# EAGLE design binarybox-barrel (EAGLE 7.3.0)
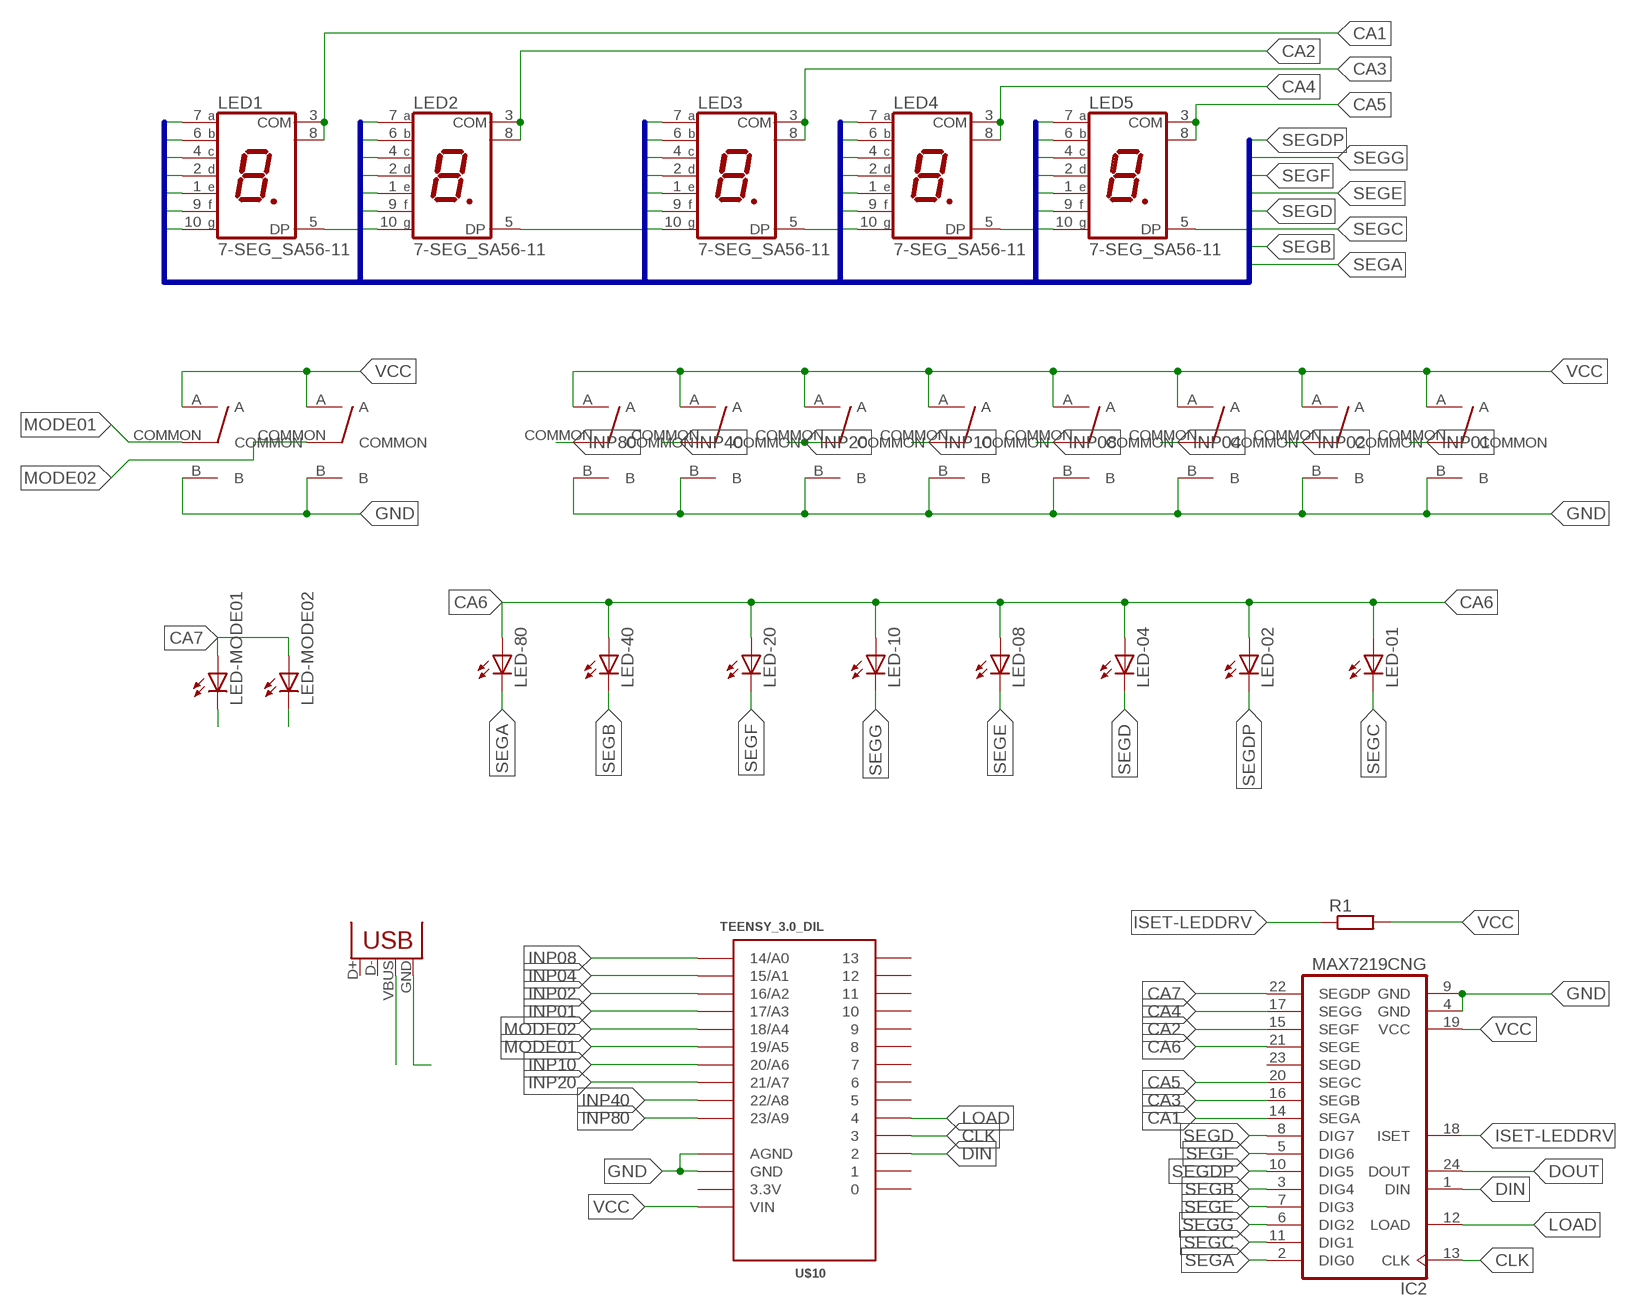
[diagram p0: schematic, sheet 1]

## Parts
IC2  MAX7219CNG  [DIL24-3]
LED1  7-SEG_SA56-11  [SA56-11]
LED2  7-SEG_SA56-11  [SA56-11]
LED3  7-SEG_SA56-11  [SA56-11]
LED4  7-SEG_SA56-11  [SA56-11]
LED5  7-SEG_SA56-11  [SA56-11]
LED-01  LED5MM  [LED5MM]
LED-02  LED5MM  [LED5MM]
LED-04  LED5MM  [LED5MM]
LED-08  LED5MM  [LED5MM]
LED-10  LED5MM  [LED5MM]
LED-20  LED5MM  [LED5MM]
LED-40  LED5MM  [LED5MM]
LED-80  LED5MM  [LED5MM]
LED-MODE01  LED5MM  [LED5MM]
LED-MODE02  LED5MM  [LED5MM]
R1  R-EU_0207/10  [0207/10]
U$1  ARROW-AB-SWITCH  [333-333]
U$2  ARROW-AB-SWITCH  [333-333]
U$3  ARROW-AB-SWITCH  [333-333]
U$4  ARROW-AB-SWITCH  [333-333]
U$5  ARROW-AB-SWITCH  [333-333]
U$6  ARROW-AB-SWITCH  [333-333]
U$7  ARROW-AB-SWITCH  [333-333]
U$8  ARROW-AB-SWITCH  [333-333]
U$10  TEENSY_3.0_DIL  [TEENSY3-DIL]
U$11  ARROW-AB-SWITCH  [333-333]
U$13  ARROW-AB-SWITCH  [333-333]
X1  USBPTH  [USB-B-PTH]

## Nets
CA1: IC2.14(SEGA) LED1.3(COM) LED1.8(COM)
CA2: IC2.15(SEGF) LED2.3(COM) LED2.8(COM)
CA3: IC2.16(SEGB) LED3.3(COM) LED3.8(COM)
CA4: IC2.17(SEGG) LED4.3(COM) LED4.8(COM)
CA5: IC2.20(SEGC) LED5.3(COM) LED5.8(COM)
CA6: IC2.21(SEGE) LED-01.A LED-02.A LED-04.A LED-08.A LED-10.A LED-20.A LED-40.A LED-80.A
CA7: IC2.22(SEGDP) LED-MODE01.A LED-MODE02.A
CLK: IC2.13(CLK) U$10.3
DIN: IC2.1(DIN) U$10.2
DOUT: IC2.24(DOUT)
GND: IC2.4(GND) IC2.9(GND) U$1.B U$2.B U$3.B U$4.B U$5.B U$6.B U$7.B U$8.B U$10.AGND U$10.GND U$11.B U$13.B X1.GND
INP01: U$8.COMMON U$10.17/A3
INP02: U$7.COMMON U$10.16/A2
INP04: U$6.COMMON U$10.15/A1
INP08: U$5.COMMON U$10.14/A0
INP10: U$4.COMMON U$10.20/A6
INP20: U$3.COMMON U$10.21/A7
INP40: U$2.COMMON U$10.22/A8
INP80: U$1.COMMON U$10.23/A9
ISET-LEDDRV: IC2.18(ISET) R1.1
LOAD: IC2.12(LOAD) U$10.4
MODE01: U$10.19/A5 U$11.COMMON
MODE02: U$10.18/A4 U$13.COMMON
SEGA: IC2.2(DIG0) LED1.7(A) LED2.7(A) LED3.7(A) LED4.7(A) LED5.7(A) LED-80.K(C)
SEGB: IC2.3(DIG4) LED1.6(B) LED2.6(B) LED3.6(B) LED4.6(B) LED5.6(B) LED-40.K(C)
SEGC: IC2.11(DIG1) LED1.4(C) LED2.4(C) LED3.4(C) LED4.4(C) LED5.4(C) LED-01.K(C) LED-MODE01.K(C)
SEGD: IC2.8(DIG7) LED1.2(D) LED2.2(D) LED3.2(D) LED4.2(D) LED5.2(D) LED-04.K(C)
SEGDP: IC2.10(DIG5) LED1.5(DP) LED2.5(DP) LED3.5(DP) LED4.5(DP) LED5.5(DP) LED-02.K(C) LED-MODE02.K(C)
SEGE: IC2.7(DIG3) LED1.1(E) LED2.1(E) LED3.1(E) LED4.1(E) LED5.1(E) LED-08.K(C)
SEGF: IC2.5(DIG6) LED1.9(F) LED2.9(F) LED3.9(F) LED4.9(F) LED5.9(F) LED-20.K(C)
SEGG: IC2.6(DIG2) LED1.10(G) LED2.10(G) LED3.10(G) LED4.10(G) LED5.10(G) LED-10.K(C)
VCC: IC2.19(VCC) R1.2 U$1.A U$2.A U$3.A U$4.A U$5.A U$6.A U$7.A U$8.A U$10.VIN U$11.A U$13.A X1.VBUS
Unconnected: IC2.23(SEGD) U$10.0 U$10.1 U$10.5 U$10.6 U$10.7 U$10.8 U$10.9 U$10.10 U$10.11 U$10.12 U$10.13 X1.D+ X1.D-

## Buses
SEG[10..17]

## Power pins joined to a net without a drawn wire
3.3V: U$10.3.3V

## Library data of the parts
IC2 = maxim:MAX7219CNG: LED DISPLAY DRIVER; MF: MAXIM; MPN: MAX7219CNG; OC_FARNELL: 1523914; OC_NEWARK: 34C4018
LED1-LED5 = display-kingbright:7-SEG_: Kingbright 14.2mm (0.56 INCH) SINGLE DIGIT NUMERIC DUISPLAY Source: SA56-11EWA(Ver1189471036.pdf; OC_FARNELL: unknown; OC_NEWARK: unknown
LED-01 LED-02 LED-04 LED-08 LED-10 LED-20 LED-40 LED-80 LED-MODE01 LED-MODE02 = led:LED: LED OSRAM: - CHIPLED LG R971, LG N971, LY N971, LG Q971, LY Q971, LO R971, LY R971 LH N974, LH R974 LS Q976, LO Q976, LY Q976 LO Q996 - Hyper CHIPLED LW Q18S LB Q993, LB Q99A, LB R99A - SideLED LS A670, LO A670, LY A670, LG A670, LP A670 LB A673, LV A673, LT A673, LW A673 LH A674 LY A675 LS A676, LA A676, LO A676, LY A676, LW A676 LS A679, LY A679, LG A679 - Hyper Micro SIDELED® LS Y876, LA Y876, LO Y876, LY Y876 LT Y87S - SmartLED LW L88C, LW L88S LB L89C, LB L89S, LG L890 LS L89K, LO L89K, LY L89K LS L896, LA L896, LO L896, LY L896 - TOPLED LS T670, LO T670, LY T670, LG T670, LP T670 LSG T670, LSP T670, LSY T670, LOP T670, LYG T670 LG T671, LOG T671, LSG T671 LB T673, LV T673, LT T673, LW T673 LH T674 LS T676, LA T676, LO T676, LY T676, LB T676, LH T676, LSB T676, LW T676 LB T67C, LV T67C, LT T67C, LS T67K, LO T67K, LY T67K, LW E67C LS E67B, LA E67B, LO E67B, LY E67B, LB E67C, LV E67C, LT E67C LW T67C LS T679, LY T679, LG T679 LS T770, LO T770, LY T770, LG T770, LP T770 LB T773, LV T773, LT T773, LW T773 LH T774 LS E675, LA E675, LY E675, LS T675 LS T776, LA T776, LO T776, LY T776, LB T776 LHGB T686 LT T68C, LB T68C - Hyper Mini TOPLED® LB M676 - Mini TOPLED Santana® LG M470 LS M47K, LO M47K, LY M47K Source: http://www.osram.convergy.de LUXEON: - LUMILED® LXK2-PW12-R00, LXK2-PW12-S00, LXK2-PW14-U00, LXK2-PW14-V00 LXK2-PM12-R00, LXK2-PM12-S00, LXK2-PM14-U00 LXK2-PE12-Q00, LXK2-PE12-R00, LXK2-PE12-S00, LXK2-PE14-T00, LXK2-PE14-U00 LXK2-PB12-K00, LXK2-PB12-L00, LXK2-PB12-M00, LXK2-PB14-N00, LXK2-PB14-P00, LXK2-PB14-Q00 LXK2-PR12-L00, LXK2-PR12-M00, LXK2-PR14-Q00, LXK2-PR14-R00 LXK2-PD12-Q00, LXK2-PD12-R00, LXK2-PD12-S00 LXK2-PH12-R00, LXK2-PH12-S00 LXK2-PL12-P00, LXK2-PL12-Q00, LXK2-PL12-R00 Source: www.luxeon.com KINGBRIGHT: KA-3528ASYC Source: www.kingbright.com
R1 = resistor:R-EU_: RESISTOR, European symbol
U$1-U$8 U$11 U$13 = switch-cr-arrow:ARROW-AB-SWITCH
U$10 = Teensy_3_and_LC_Series_Boards_v1.0:TEENSY_3.0_DIL: TEENSY 3.0 in a classic breadboard layout - pins between the two outer rows.
X1 = SparkFun:USB: USB Connectors USB-B-PTH is fully proven SKU : PRT-00139 USB-miniB is fully proven SKU : PRT-00587 USB-A-PCB is untested. USB-A-H is throughly reviewed, but untested. Spark Fun Electronics SKU : PRT-00437 USB-B-SMT is throughly reviewed, but untested. Needs silkscreen touching up. USB-A-S has not been used/tested USB-MB-H has not been used/tested

## Board
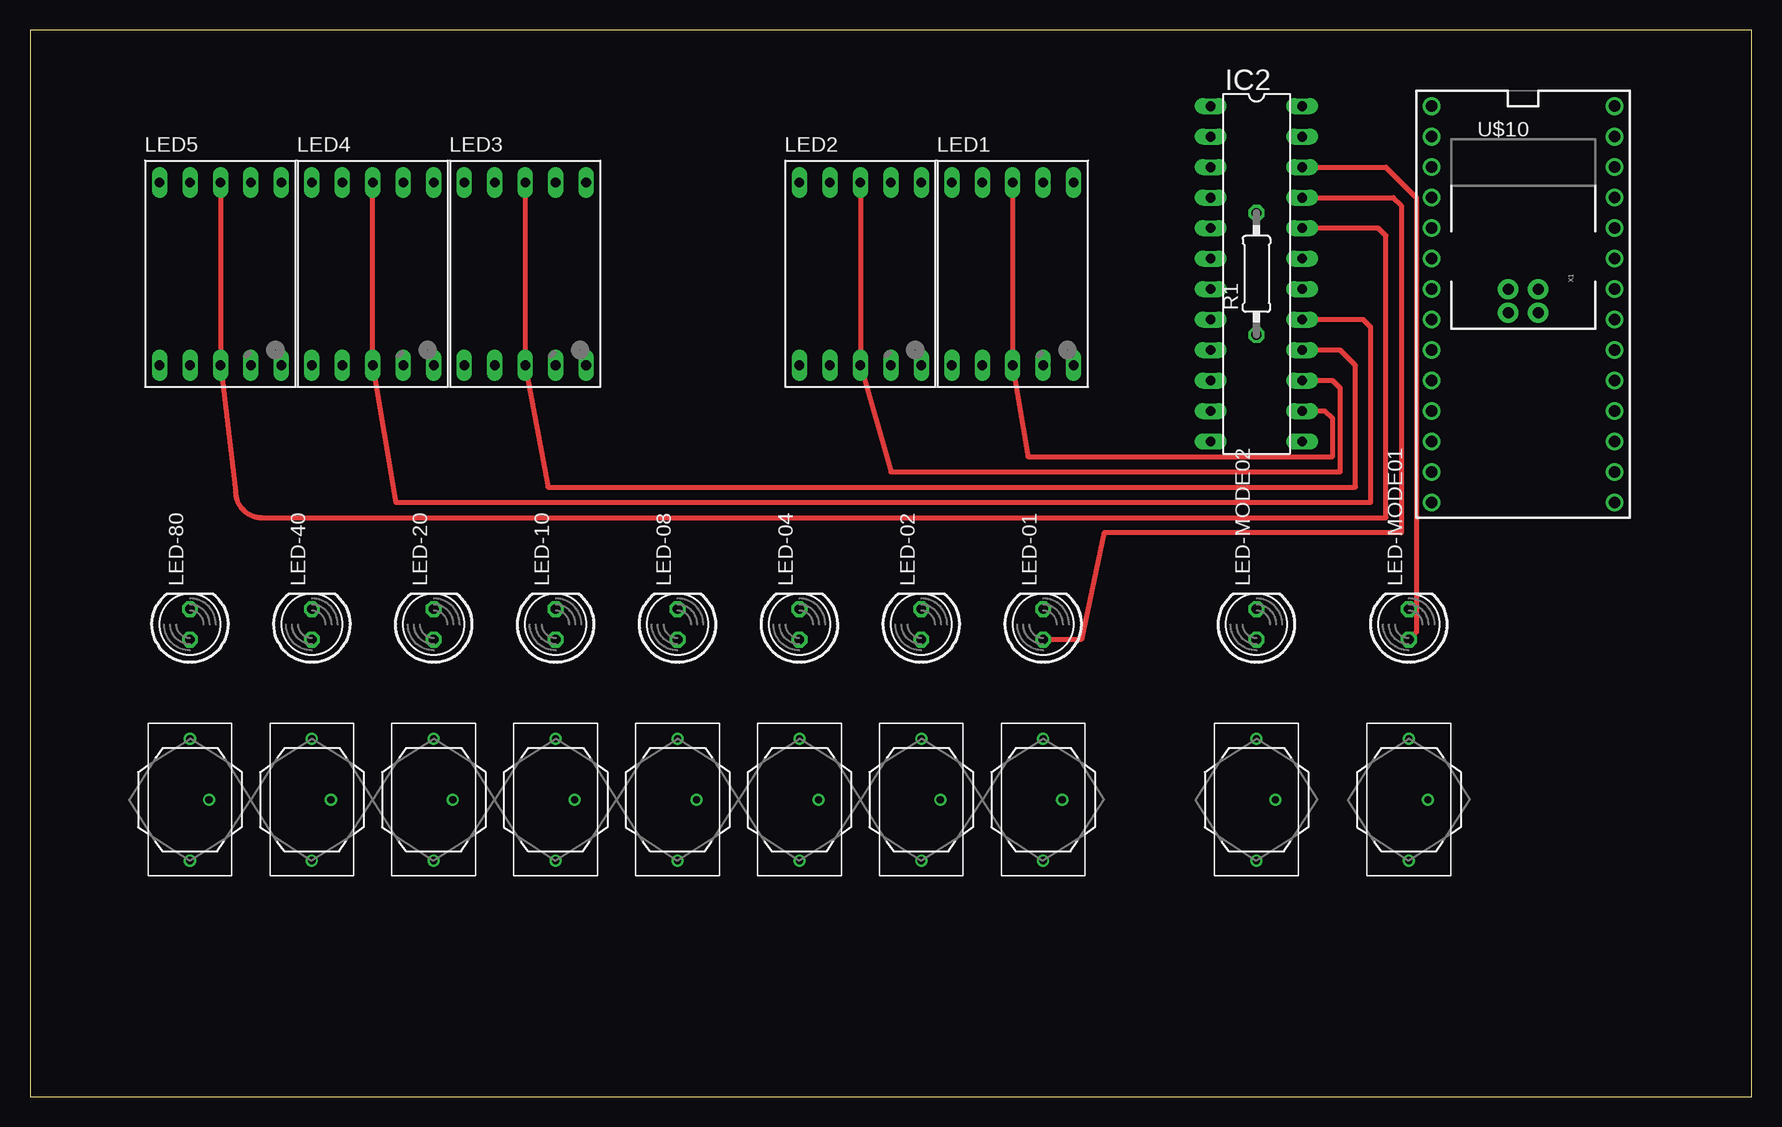
[diagram p1: board, top side]
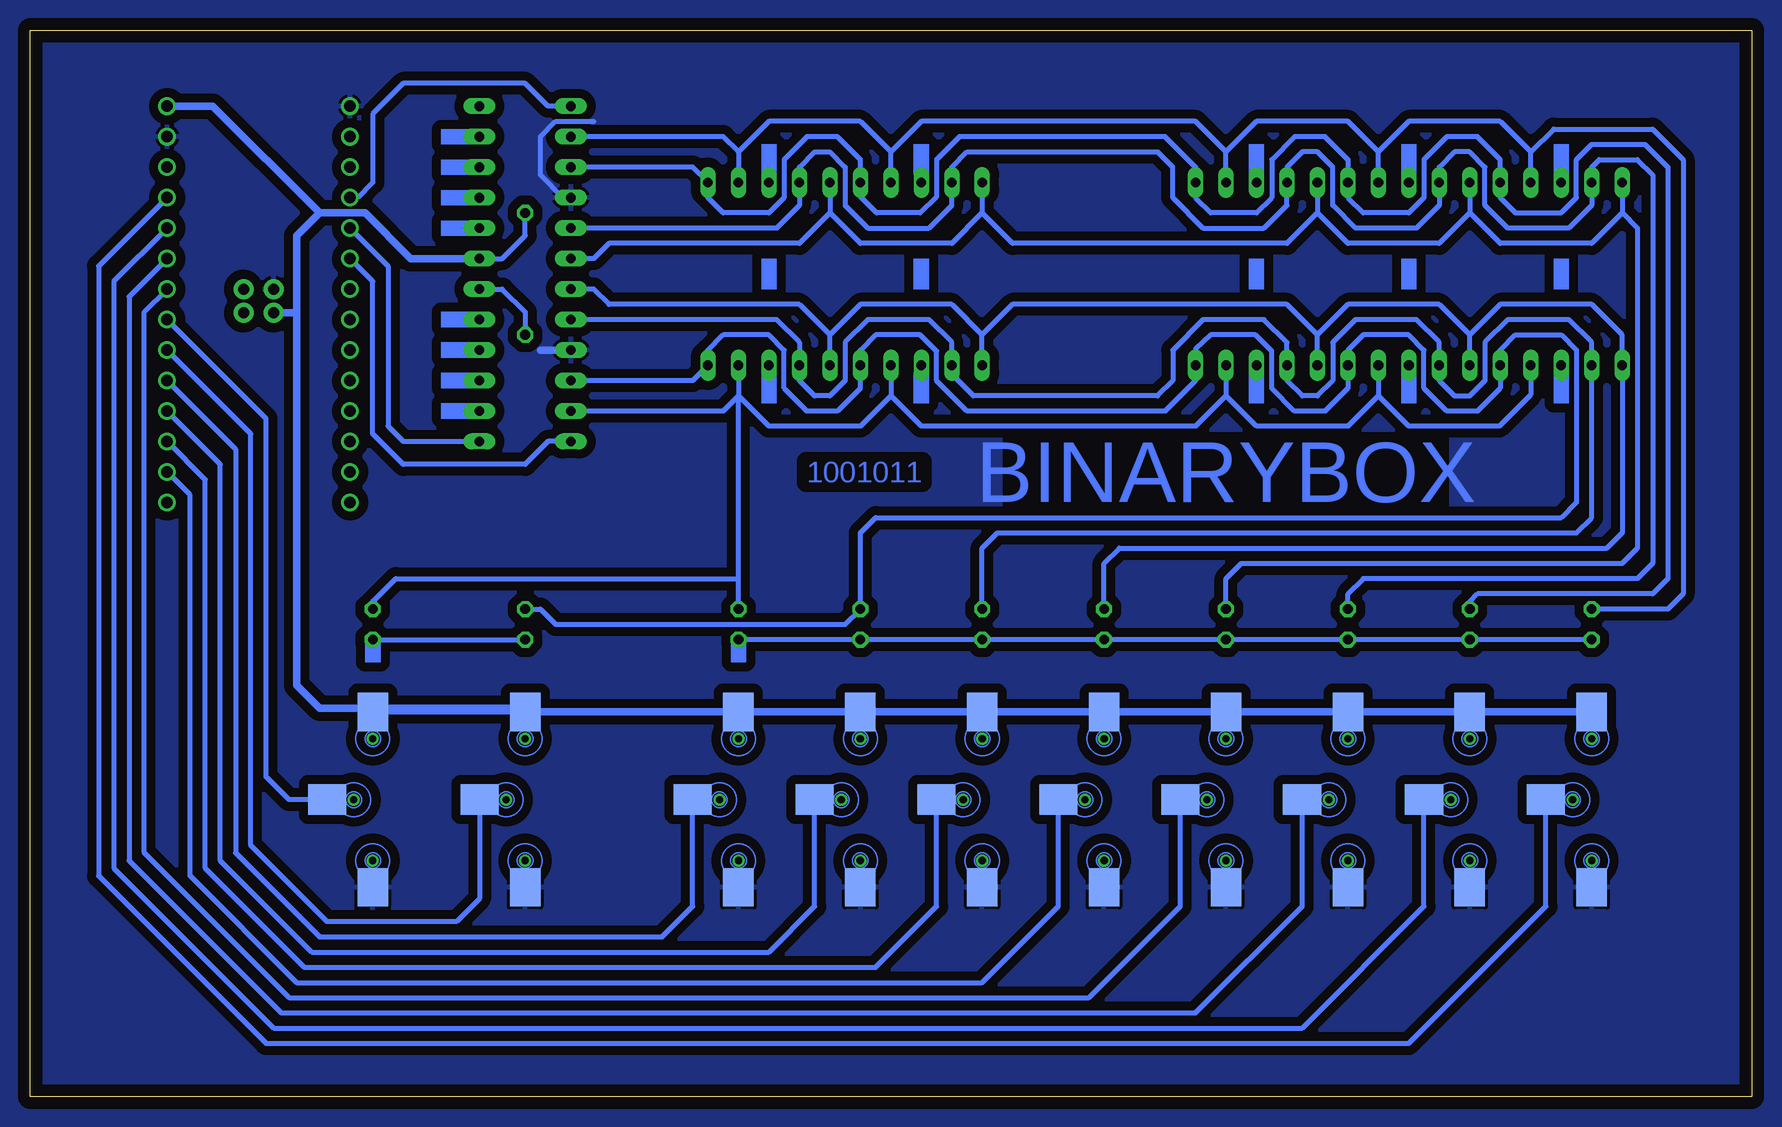
[diagram p2: board, bottom side, seen from below]

Size 143.51 x 88.9 mm. Coordinates in mm from the lower left corner, seen from the top.
Outline: 0,0 143.51,0 143.51,88.9 0,88.9 0,0
Copper layers (1*16): Top 0.035mm / dielectric 1.5mm / Bottom 0.035mm
Design rules "default": minimum track width 10mil, minimum drill 24mil, track to track 8mil, track to pad 8mil, pad to pad 8mil, via to via 8mil, smd to smd 8mil, copper to edge 40mil, drill to drill 8mil, minimum pad ring 10mil, minimum via ring 8mil, stop-mask expansion 4mil, vias tented up to drill 0mil, thermal gap 10mil

### Footprints (pad centres in the part's own frame; a part is rotated, then mirrored left to right if it is on the bottom)
DIL24-3 = drill 0.813 long: 1 -13.97,-3.81; 2 -11.43,-3.81; 3 -8.89,-3.81; 4 -6.35,-3.81; 5 -3.81,-3.81; 6 -1.27,-3.81; 7 1.27,-3.81; 8 3.81,-3.81; 9 6.35,-3.81; 10 8.89,-3.81; 11 11.43,-3.81; 12 13.97,-3.81; 13 13.97,3.81; 14 11.43,3.81; 15 8.89,3.81; 16 6.35,3.81; 17 3.81,3.81; 18 1.27,3.81; 19 -1.27,3.81; 20 -3.81,3.81; 21 -6.35,3.81; 22 -8.89,3.81; 23 -11.43,3.81; 24 -13.97,3.81
SA56-11 = drill 0.8 long: 1 -5.08,-7.62; 2 -2.54,-7.62; 3 0,-7.62; 4 2.54,-7.62; 5 5.08,-7.62; 6 5.08,7.62; 7 2.54,7.62; 8 0,7.62; 9 -2.54,7.62; 10 -5.08,7.62
LED5MM = drill 0.813 octagon: A -1.27,0; K 1.27,0
0207/10 = drill 0.813 octagon: 1 -5.08,0; 2 5.08,0
333-333 = smd 2.54 x 3.175 bottom: A 0,7.303; B 0,-7.303 | smd 3.175 x 2.54 bottom: COMMON 3.81,0
TEENSY3-DIL = drill 0.965: 0 -7.62,13.97; 1 -7.62,11.43; 2 -7.62,8.89; 3 -7.62,6.35; 3.3V 7.62,11.43; 4 -7.62,3.81; 5 -7.62,1.27; 6 -7.62,-1.27; 7 -7.62,-3.81; 8 -7.62,-6.35; 9 -7.62,-8.89; 10 -7.62,-11.43; 11 -7.62,-13.97; 12 -7.62,-16.51; 13 7.62,-16.51; 14/A0 7.62,-13.97; 15/A1 7.62,-11.43; 16/A2 7.62,-8.89; 17/A3 7.62,-6.35; 18/A4 7.62,-3.81; 19/A5 7.62,-1.27; 20/A6 7.62,1.27; 21/A7 7.62,3.81; 22/A8 7.62,6.35; 23/A9 7.62,8.89; AGND 7.62,13.97; GND -7.62,16.51; VIN 7.62,16.51
USB-B-PTH = drill 0.914 pad 1.676: D+ 0,1.25; D- 1.981,1.25; GND 0,-1.25; VBUS 1.981,-1.25

### Placement (x,y rotation side)
IC2  102.23,68.58 270 top
LED1  81.92,68.58 0 top
LED2  69.22,68.58 0 top
LED3  41.27,68.58 0 top
LED4  28.57,68.58 0 top
LED5  15.88,68.58 0 top
LED-01  84.45,39.37 90 top
LED-02  74.3,39.37 90 top
LED-04  64.14,39.37 90 top
LED-08  53.98,39.37 90 top
LED-10  43.81,39.37 90 top
LED-20  33.66,39.37 90 top
LED-40  23.5,39.37 90 top
LED-80  13.34,39.37 90 top
LED-MODE01  114.94,39.37 90 top
LED-MODE02  102.23,39.37 90 top
R1  102.23,68.58 90 top
U$1  13.34,24.77 0 top
U$2  23.5,24.77 0 top
U$3  33.66,24.77 0 top
U$4  43.81,24.77 0 top
U$5  53.98,24.77 0 top
U$6  64.14,24.77 0 top
U$7  74.3,24.77 0 top
U$8  84.45,24.77 0 top
U$10  124.46,66.04 0 top
U$11  114.94,24.77 0 top
U$13  102.23,24.77 0 top
X1  124.46,67.31 270 top

### Tracks (layer width: path | path; a pad name or v marks a point on that pad's centre or on a via)
CA1
  Top 0.406: IC2.14 107.95,57.15 108.58,56.52 108.58,53.34 83.19,53.34 LED1.3 LED1.8
CA2
  Top 0.406: IC2.15 108.58,59.69 109.22,59.05 109.22,52.07 71.75,52.07 LED2.3 LED2.8
CA3
  Top 0.406: IC2.16 109.22,62.23 110.49,60.96 110.49,50.8 43.18,50.8 LED3.3 LED3.8
CA4
  Top 0.406: IC2.17 111.12,64.77 111.76,64.14 111.76,49.53 30.48,49.53 LED4.3 LED4.8
CA5
  Top 0.406: IC2.20 112.39,72.39 113.03,71.75 113.03,48.26 19.3,48.26 arc-90 17.14,50.42 LED5.3 LED5.8
CA6
  Top 0.406: IC2.21 113.67,74.93 114.3,74.3 114.3,46.99 89.53,46.99 87.63,38.1 LED-01.A
  Bottom 0.406: LED-80.A LED-40.A LED-20.A LED-10.A LED-08.A LED-04.A LED-02.A LED-01.A
CA7
  Top 0.406: IC2.22 113.03,77.47 115.57,74.93 115.57,38.73 LED-MODE01.A
  Bottom 0.406: LED-MODE01.A LED-MODE02.A
CLK
  Bottom 0.406: IC2.13 112.39,54.61 113.67,55.88 113.67,69.22 U$10.3
DIN
  Bottom 0.406: U$10.2 116.2,74.93 114.94,76.2 114.94,81.92 112.39,84.45 102.23,84.45 100.33,82.55 IC2.1
GND
  Bottom 0.406: IC2.4 99.06,74.93 100.97,76.83 100.97,80.01 99.69,81.28 96.52,81.28
  Bottom 0.61: IC2.9 100.97,62.23
  pour Bottom (isolate 0.762): -9.53,93.98 151.13,93.98 151.13,-5.08 -9.53,-5.08
INP01
  Bottom 0.406: U$8.COMMON 88.27,15.88 90.81,13.34 119.38,13.34 126.36,20.32 126.36,53.98 U$10.17/A3
INP02
  Bottom 0.406: U$7.COMMON 78.11,15.88 81.92,12.06 120.02,12.06 127.64,19.68 127.64,52.7 U$10.16/A2
INP04
  Bottom 0.406: U$6.COMMON 67.94,15.88 73.03,10.79 120.65,10.79 128.91,19.05 128.91,51.44 U$10.15/A1
INP08
  Bottom 0.406: U$5.COMMON 57.78,15.88 64.14,9.53 121.28,9.53 130.18,18.41 130.18,50.16 U$10.14/A0
INP10
  Bottom 0.406: U$4.COMMON 47.62,15.88 55.24,8.26 121.92,8.26 133.99,20.32 133.99,65.41 U$10.20/A6
INP20
  Bottom 0.406: U$3.COMMON 37.47,15.88 46.35,6.99 122.56,6.99 135.25,19.68 135.25,66.67 U$10.21/A7
INP40
  Bottom 0.406: U$2.COMMON 27.3,15.88 37.47,5.71 123.19,5.71 136.53,19.05 136.53,67.94 U$10.22/A8
INP80
  Bottom 0.406: U$1.COMMON 17.14,15.88 28.57,4.45 123.83,4.45 137.79,18.41 137.79,69.22 U$10.23/A9
ISET-LEDDRV
  Bottom 0.406: IC2.18 104.14,67.31 102.23,65.41 R1.1
LOAD
  Bottom 0.406: IC2.12 100.33,54.61 102.23,52.7 112.39,52.7 114.94,55.24 114.94,67.94 U$10.4
MODE01
  Bottom 0.406: U$11.COMMON 121.92,24.77 123.83,26.67 123.83,56.52 U$10.19/A5
MODE02
  Bottom 0.406: U$13.COMMON 106.05,16.51 107.95,14.61 118.75,14.61 125.09,20.95 125.09,55.24 U$10.18/A4
N$1  (via drill 0.6)
  other vias: 13.34,29.84
N$2  (via drill 0.6)
  other vias: 14.92,24.77
N$3  (via drill 0.6)
  other vias: 23.5,29.84
N$4  (via drill 0.6)
  other vias: 25.08,24.77
N$5  (via drill 0.6)
  other vias: 13.34,19.68
N$6  (via drill 0.6)
  other vias: 102.23,29.84
N$7  (via drill 0.6)
  other vias: 114.94,29.84
N$9  (via drill 0.6)
  other vias: 116.52,24.77
N$10  (via drill 0.6)
  other vias: 103.82,24.77
N$11  (via drill 0.6)
  other vias: 102.23,19.68
N$12  (via drill 0.6)
  other vias: 114.94,19.68
N$17  (via drill 0.6)
  other vias: 23.5,19.68
N$18  (via drill 0.6)
  other vias: 33.66,29.84
N$19  (via drill 0.6)
  other vias: 35.24,24.77
N$20  (via drill 0.6)
  other vias: 33.66,19.68
N$21  (via drill 0.6)
  other vias: 43.81,19.68
N$22  (via drill 0.6)
  other vias: 45.4,24.77
N$23  (via drill 0.6)
  other vias: 43.81,29.84
N$24  (via drill 0.6)
  other vias: 53.98,29.84
N$25  (via drill 0.6)
  other vias: 55.56,24.77
N$26  (via drill 0.6)
  other vias: 53.98,19.68
N$27  (via drill 0.6)
  other vias: 64.14,19.68
N$28  (via drill 0.6)
  other vias: 65.72,24.77
N$29  (via drill 0.6)
  other vias: 64.14,29.84
N$30  (via drill 0.6)
  other vias: 74.3,29.84
N$31  (via drill 0.6)
  other vias: 75.88,24.77
N$32  (via drill 0.6)
  other vias: 74.3,19.68
N$33  (via drill 0.6)
  other vias: 84.45,19.68
N$34  (via drill 0.6)
  other vias: 86.04,24.77
N$35  (via drill 0.6)
  other vias: 84.45,29.84
SEGA
  Bottom 0.406: LED5.7 18.41,78.74 | LED4.7 31.11,78.74 | LED3.7 43.81,78.74 | LED2.7 71.75,78.74 | 84.45,78.74 LED1.7 | 18.41,78.74 20.95,81.28 28.57,81.28 31.11,78.74 | 31.11,78.74 33.66,81.28 41.27,81.28 43.81,78.74 | 43.81,78.74 46.35,81.28 69.22,81.28 71.75,78.74 | 71.75,78.74 74.3,81.28 81.92,81.28 84.45,78.74 | 18.41,78.74 16.51,80.64 8.26,80.64 5.71,78.11 5.71,41.91 6.99,40.64 LED-80.K | 84.45,78.74 85.72,80.01 IC2.2
SEGB
  Bottom 0.406: LED-40.K 23.5,41.27 22.86,41.91 8.26,41.91 6.99,43.18 6.99,77.47 8.89,79.38 13.34,79.38 14.61,78.11 14.61,74.93 15.88,73.66 19.68,73.66 20.95,74.93 LED5.6 20.95,78.11 22.86,80.01 25.4,80.01 27.3,78.11 27.3,74.93 28.57,73.66 32.38,73.66 33.66,74.93 LED4.6 33.66,78.11 35.56,80.01 38.1,80.01 40.01,78.11 40.01,74.93 41.27,73.66 45.09,73.66 46.35,74.93 LED3.6 46.35,77.47 48.9,80.01 66.04,80.01 67.94,78.11 67.94,75.03 69.31,73.66 72.93,73.66 74.3,75.03 LED2.6 74.3,78.11 76.2,80.01 78.74,80.01 80.64,78.11 80.64,74.93 81.92,73.66 85.72,73.66 87,74.93 LED1.6 88.27,77.47 IC2.3
SEGC
  Bottom 0.406: LED5.4 18.41,58.51 21.05,55.88 28.57,55.88 31.11,58.42 | LED4.4 31.11,58.42 | LED3.4 43.81,58.42 | LED2.4 71.75,58.42 | 84.45,58.42 81.92,55.88 74.3,55.88 71.75,58.42 | 43.81,58.42 46.35,55.88 69.22,55.88 71.75,58.42 | 43.81,58.42 41.27,55.88 33.66,55.88 31.11,58.42 | LED1.4 84.45,58.42 | LED-01.K 84.45,43.18 | 84.45,43.18 84.45,58.42 | 84.45,58.42 85.72,57.15 IC2.11 | LED-MODE01.K 114.94,41.27 113.03,43.18 84.45,43.18
SEGD
  Bottom 0.406: LED-04.K 64.14,45.72 62.87,46.99 14.61,46.99 13.34,48.26 LED5.2 13.34,62.87 15.24,64.77 20.32,64.77 22.23,62.87 22.23,59.69 23.5,58.42 24.77,58.42 26.04,59.69 LED4.2 26.04,62.87 27.94,64.77 33.02,64.77 34.92,62.87 34.92,59.69 36.2,58.42 37.47,58.42 38.73,59.69 LED3.2 38.73,62.87 40.64,64.77 45.72,64.77 48.26,62.23 48.26,59.69 49.53,58.42 64.88,58.42 66.67,60.22 LED2.2 66.67,62.87 68.58,64.77 73.66,64.77 75.56,62.87 75.56,59.69 76.83,58.42 78.11,58.42 79.38,59.69 LED1.2 79.38,62.87 81.28,64.77 IC2.8
SEGDP
  Bottom 0.406: IC2.10 88.27,59.69 LED1.5 87,62.23 85.72,63.5 81.92,63.5 80.64,62.23 80.64,59.05 78.74,57.15 76.2,57.15 74.3,59.05 LED2.5 74.3,62.23 73.03,63.5 69.31,63.5 67.94,62.13 67.94,59.69 65.41,57.15 48.9,57.15 46.35,59.69 LED3.5 46.35,62.31 45.09,63.5 41.37,63.5 40.01,62.13 40.01,59.05 38.1,57.15 35.56,57.15 33.66,59.05 LED4.5 33.66,62.23 32.38,63.5 28.57,63.5 27.3,62.23 27.3,59.05 25.4,57.15 22.86,57.15 20.95,59.05 LED5.5 20.95,62.23 19.68,63.5 15.88,63.5 14.61,62.23 14.61,49.53 15.88,48.26 73.03,48.26 74.3,46.99 LED-02.K 75.56,39.37 99.69,39.37 100.97,40.64 LED-MODE02.K
SEGE
  Bottom 0.406: LED4.1 23.5,63.5 | LED3.1 36.2,63.5 | LED2.1 64.14,63.5 | LED1.1 76.83,63.5 | 23.5,63.5 20.95,66.04 13.34,66.04 10.79,63.5 LED5.1 10.79,46.99 12.06,45.72 52.7,45.72 53.98,44.45 LED-08.K | 23.5,63.5 26.04,66.04 33.66,66.04 36.2,63.5 | 36.2,63.5 38.73,66.04 61.59,66.04 64.14,63.5 | 64.14,63.5 66.67,66.04 74.3,66.04 76.83,63.5 | 76.83,63.5 79.38,66.04 95.25,66.04 96.52,67.31 IC2.7
SEGF
  Bottom 0.406: LED-20.K 33.66,41.91 32.38,43.18 9.53,43.18 8.26,44.45 8.26,76.83 9.53,78.11 12.7,78.11 13.34,77.47 LED5.9 13.34,74.3 15.24,72.39 20.32,72.39 22.23,74.3 22.23,77.47 23.5,78.74 24.77,78.74 26.04,77.47 LED4.9 26.04,74.3 27.94,72.39 33.02,72.39 34.92,74.3 34.92,77.47 36.2,78.74 37.47,78.74 38.73,77.47 LED3.9 38.73,74.3 40.64,72.39 45.72,72.39 48.26,74.93 48.26,77.47 49.53,78.74 65.41,78.74 66.67,77.47 LED2.9 66.67,74.3 68.58,72.39 73.66,72.39 75.56,74.3 75.56,77.47 76.83,78.74 78.11,78.74 79.38,77.47 LED1.9 79.38,74.3 81.28,72.39 IC2.5
SEGG
  Bottom 0.406: LED4.10 23.5,73.66 | LED3.10 36.2,73.66 | LED2.10 64.14,73.66 | LED1.10 76.83,73.66 | 10.79,73.66 13.34,71.12 20.95,71.12 23.5,73.66 | 23.5,73.66 26.04,71.12 33.66,71.12 36.2,73.66 | 36.2,73.66 38.73,71.12 61.59,71.12 64.14,73.66 | 64.14,73.66 66.67,71.12 74.3,71.12 76.83,73.66 | 76.83,73.66 79.38,71.12 95.25,71.12 96.52,69.85 IC2.6 | LED5.10 10.79,73.66 | 10.79,73.66 9.53,72.39 9.53,45.72 10.79,44.45 42.55,44.45 43.81,43.18 LED-10.K
VCC
  Bottom 0.406: U$11.A U$13.A 102.23,32.38 | IC2.19 104.14,69.85 102.23,71.75 R1.2 | 121.36,65.33 121.28,65.41
  Bottom 0.61: U$1.A U$2.A U$3.A U$4.A U$5.A U$6.A U$7.A U$8.A U$13.A | IC2.19 111.76,69.85 115.57,73.66 119.38,73.66 | 102.23,32.38 119.38,32.38 121.28,34.29 121.28,65.41 121.28,71.75 119.38,73.66 | X1.VBUS 121.36,65.33 | U$10.VIN 128.27,82.55 119.38,73.66
(copper drawn outside any net)
  shapes: Bottom area x25

### Text on the board
Bottom: BINARYBOX | 1001011
_tsilk: Mode | Decimal | Hex | B i n a r y